# EAGLE design RTK_mosaic-X5_Rear_Panel (EAGLE 9.6.2)
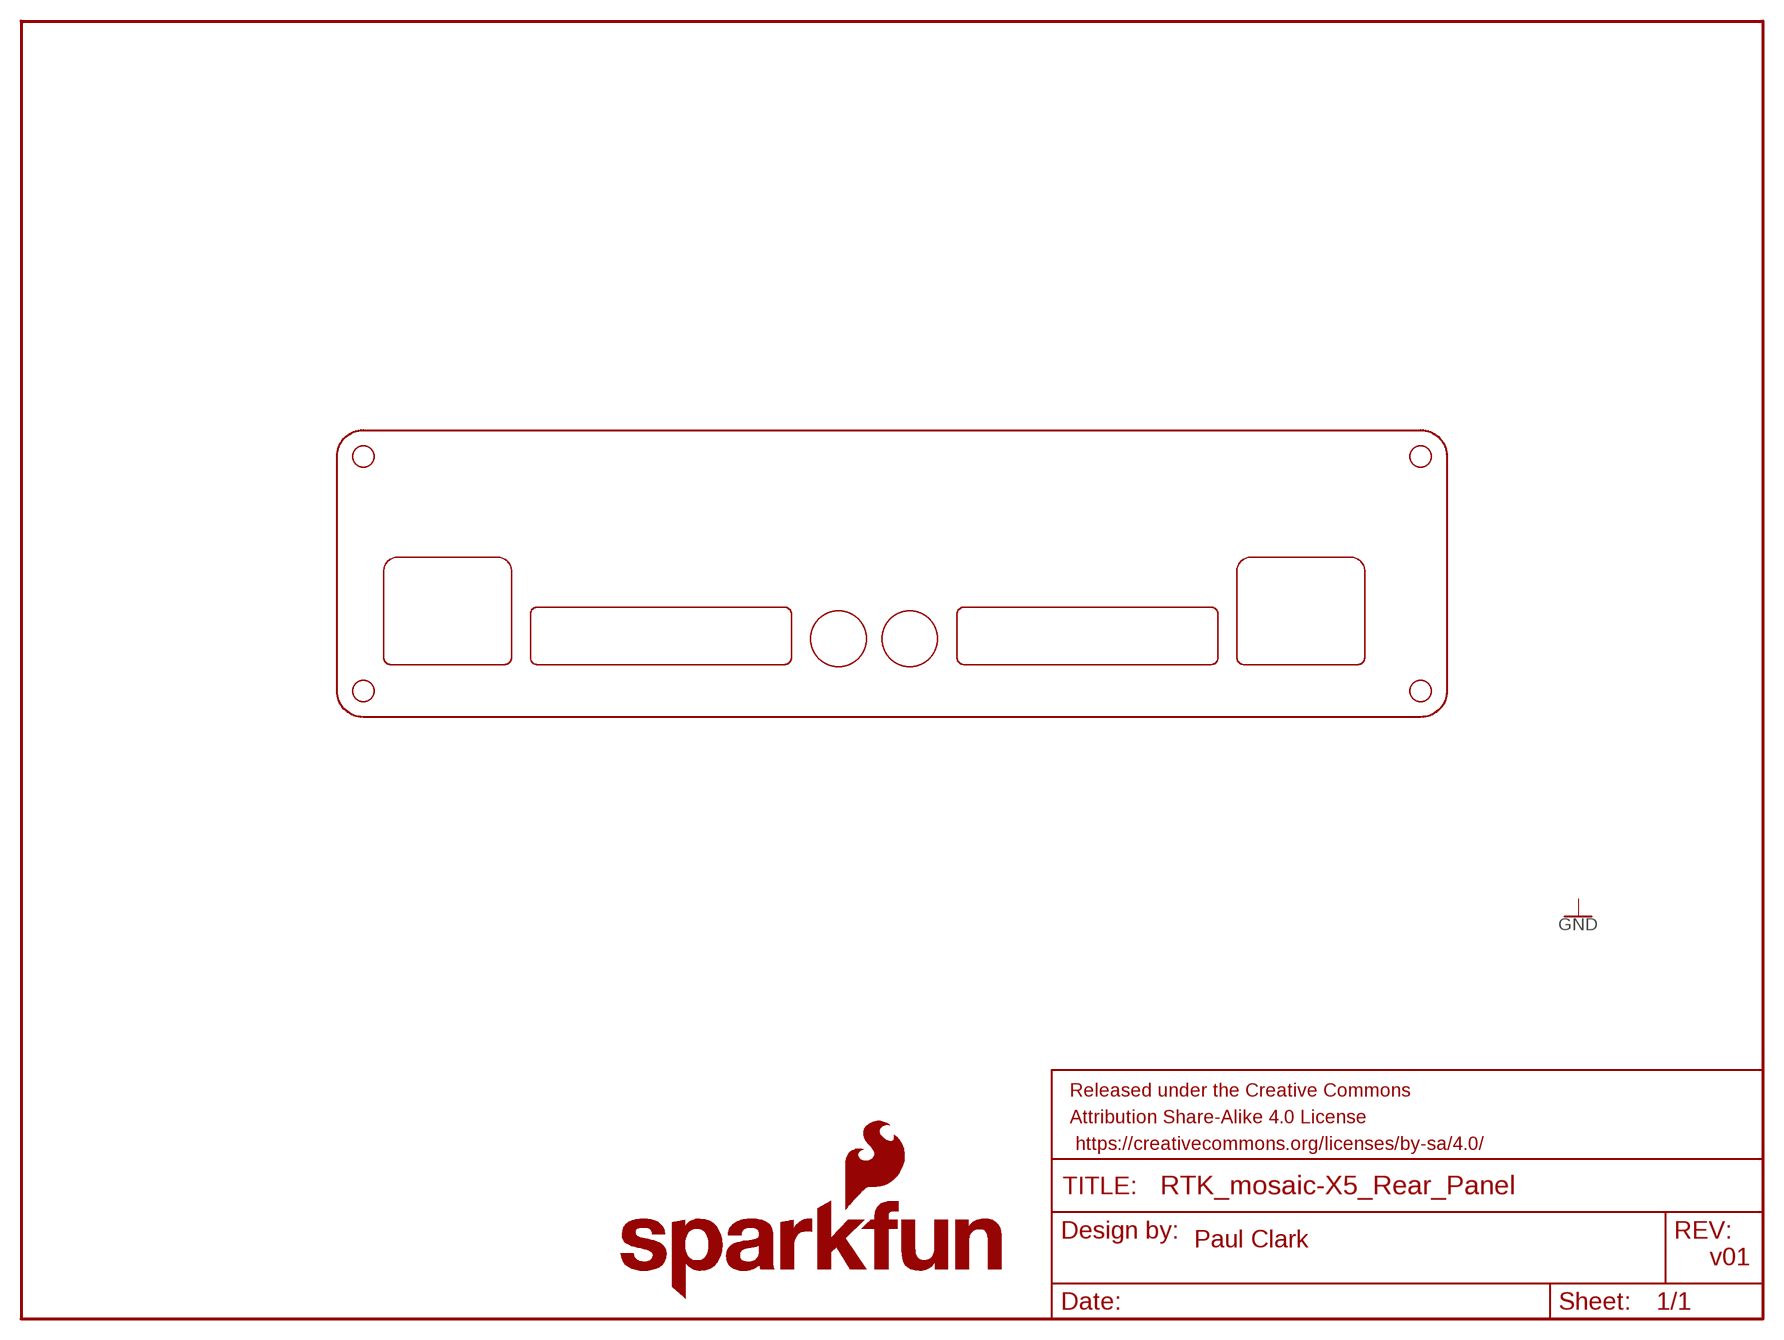
[diagram p0: schematic, sheet 1]

## Parts
FRAME1  FRAME-LETTER  [CREATIVE_COMMONS]
LOGO1  SFE_LOGO_NAME_FLAME.2_INCH  [SFE_LOGO_NAME_FLAME_.2]
PANEL_OUTLINE  PANEL_OUTLINE  [PANEL_OUTLINE]
U$2  3.5MM_CONNECTOR_CONN-17279  [3.5MM_CONNECTOR]
U$8  3.5MM_CONNECTOR_CONN-17279  [3.5MM_CONNECTOR]
U$13  ETHERNET_MAG_JACK_CONN-16253  [ETHERNET]
U$15  SMA_CONN-08289  [SMA]
U$21  SMA_CONN-08289  [SMA]
U$25  ETHERNET_MAG_JACK_CONN-16253  [ETHERNET]

## Notes on the sheet
- Paul Clark
- v01

## Library data of the parts
FRAME1 = SparkFun-Aesthetics:FRAME-LETTER: Schematic Frame - Letter Standard 8.5x11 US Letter frame
LOGO1 = SparkFun-Aesthetics:SFE_LOGO_NAME_FLAME: SparkFun Font Logo w/ Flame This is the SparkFun full logo. The logo on the schematic will always be the same size; the package variant is the height of the flame part of the logo. Default layer for the logo on the board is tSilk.
PANEL_OUTLINE = CORS_Panels:PANEL_OUTLINE: Panel Outline Centered on the top surface of the PCB
U$2 U$8 = SparkFun-Enclosure-Panel:3.5MM_CONNECTOR_CONN-17279: This is the enclosure panel cut-out for the 10-way 3.5mm header <https://www.sparkfun.com/products/22461> (CONN-17279)
U$13 U$25 = SparkFun-Enclosure-Panel:ETHERNET_MAG_JACK_CONN-16253: This is the enclosure panel cut-out for the Ethernet mag jack (PoE) (MAGJACK-POE, CONN-16253)
U$15 U$21 = SparkFun-Enclosure-Panel:SMA_CONN-08289: This is the enclosure panel cut-out for the Edge-mount SMA connector <https://www.sparkfun.com/products/593> (CONN-08289) and Edge-mount SMA RP connector <https://www.sparkfun.com/products/592> (CONN-00827)

## Board
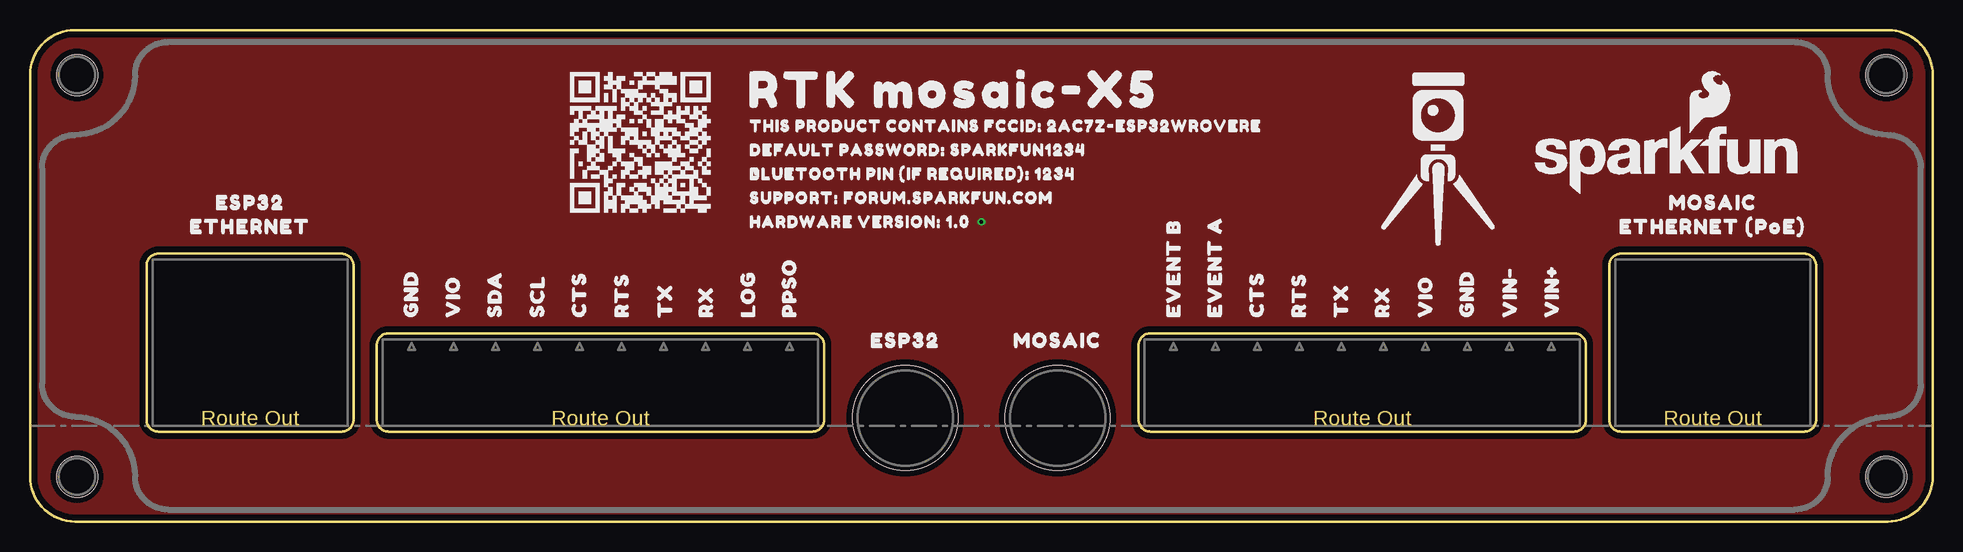
[diagram p1: board, top side]
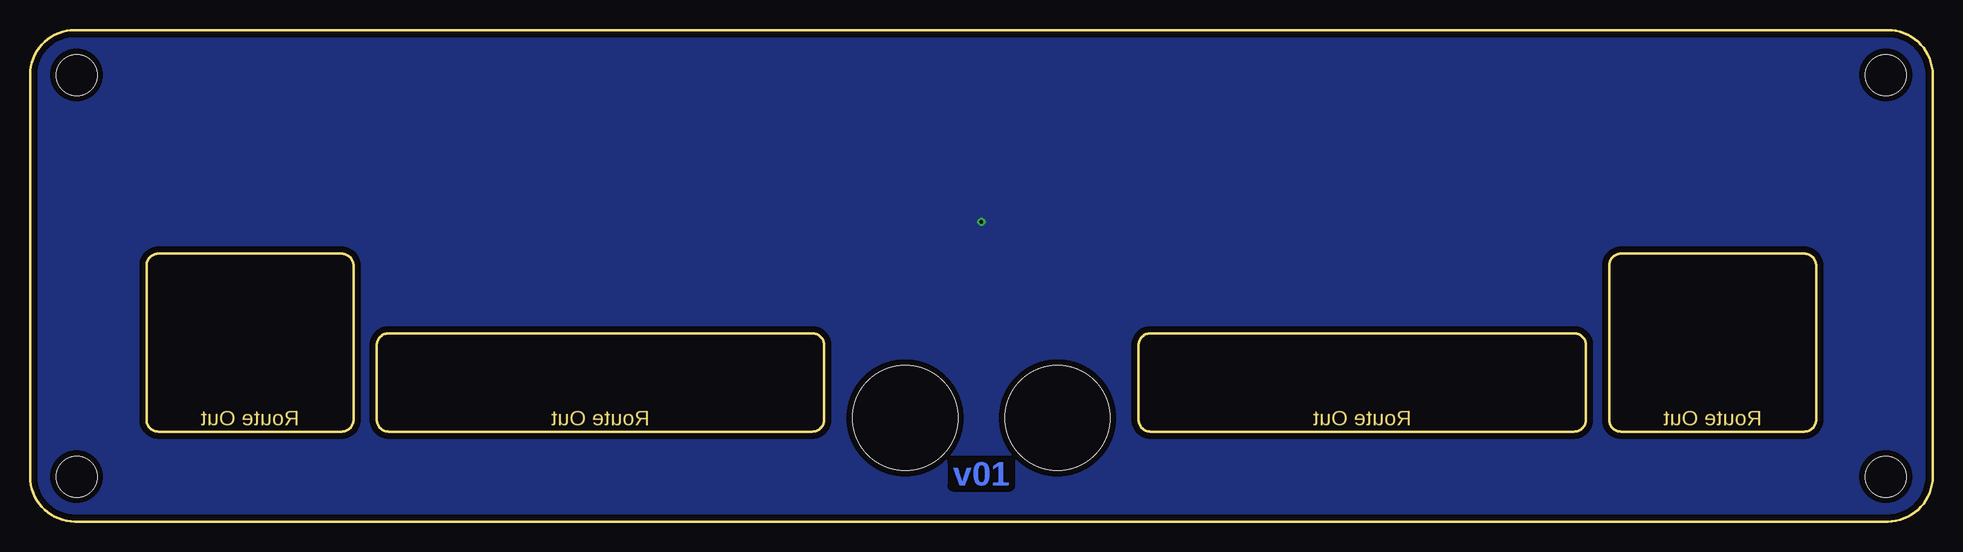
[diagram p2: board, bottom side, seen from below]

Size 158.6 x 41 mm. Coordinates in mm from the lower left corner, seen from the top.
Outline: 0,3.75 arc90 3.75,0 154.85,0 arc90 158.6,3.75 158.6,37.25 arc90 154.85,41 3.75,41 arc90 0,37.25 0,3.75
Copper layers (1*16): Top 0.035mm / dielectric 1.5mm / Bottom 0.035mm
Design rules "SparkFun-2-Layer-General-JLCPCB": minimum track width 7mil, minimum drill 0.3mm, track to track 7mil, track to pad 7mil, pad to pad 7mil, via to via 7mil, smd to smd 7mil, copper to edge 7mil, drill to drill 7mil, minimum pad ring 7mil, minimum via ring 7mil, stop-mask expansion 3mil, vias tented up to drill 25mil, thermal gap 10mil

### Footprints (pad centres in the part's own frame; a part is rotated, then mirrored left to right if it is on the bottom)
PANEL_OUTLINE = hole 3.4: -75.4,29.25; 75.4,29.25; 75.4,-4.25; -75.4,-4.25
SMA = hole 8.75: 0,0.635

### Placement (x,y rotation side)
FRAME1  60.25,-16.13 0 top  (outside the outline)
LOGO1  136.45,30.18 0 top
PANEL_OUTLINE  79.32,8 0 top
U$1  [VIN#0]  123.34,16.2 90 top
U$2  47.55,8 0 top
U$3  [BLUETOOTH_PIN_#IF_REQUIRED##_12340]  59.3,29 0 top
U$4  [SUPPORT#_FORUM#SPARKFUN#COM0]  59.3,27 0 top
U$5  [VIO9]  116.3,16.2 90 top
U$6  [VIN#1]  126.84,16.2 90 top
U$7  [HARDWARE_VERSION#_1#00]  59.3,25 0 top
U$8  111.05,8 0 top
U$9  [RX1]  112.72,16.2 90 top
U$10  [TX2]  109.28,16.2 90 top
U$11  [RTS3]  105.77,16.2 90 top
U$12  [SCL225]  42.29,16.2 90 top
U$13  18.34,8 0 top
U$14  [CTS4]  102.26,16.2 90 top
U$15  72.95,8 0 top
U$16  [SDA226]  38.74,16.2 90 top
U$17  [EVENT_A5]  98.75,16.2 90 top
U$18  [GND227]  119.76,16.2 90 top
U$19  [THIS_PRODUCT_CONTAINS_FCCID#_2AC7Z#ESP32WROVERE0]  59.3,33 0 top
U$20  [DEFAULT_PASSWORD#_SPARKFUN12340]  59.3,31 0 top
U$21  85.65,8 0 top
U$22  [RTK_MOSAIC#X50]  77,36 0 top
U$23  [EVENT_B6]  95.31,16.2 90 top
U$24  [PPSO7]  63.29,16.2 90 top
U$25  140.26,8 0 top
U$26  [LOG8]  59.85,16.2 90 top
U$27  [RX1]  56.34,16.2 90 top
U$28  [TX2]  52.93,16.2 90 top
U$29  [ESP324]  72.95,15.1 0 top
U$30  [RTS3]  49.32,16.2 90 top
U$31  [CTS4]  45.78,16.2 90 top
U$32  [VIO9]  35.25,16.2 90 top
U$33  [GND227]  31.76,16.2 90 top
U$34  [ETHERNET0]  18.34,24.6 0 top
U$35  [MOSAIC1]  140.26,26.6 0 top
U$36  [MOSAIC1]  85.65,15.1 0 top
U$37  [ESP324]  18.34,26.6 0 top
U$42  [_ETHERNET_#POE#_22337]  140.26,24.6 0 top

### Tracks (layer width: path | path; a pad name or v marks a point on that pad's centre or on a via)
GND  (via drill 0.3)
  other vias: 79.3,25
  pour Top (isolate 0.5, no thermals): 0,41 158.6,41 158.6,0 0,0
  pour Bottom (isolate 0.5, no thermals): 0,41 158.6,41 158.6,0 0,0

### Text on the board
Bottom: v01
tDocu: Paul Clark